# Altium schematic sheet USB_and_FTDI.SchDoc
size A4
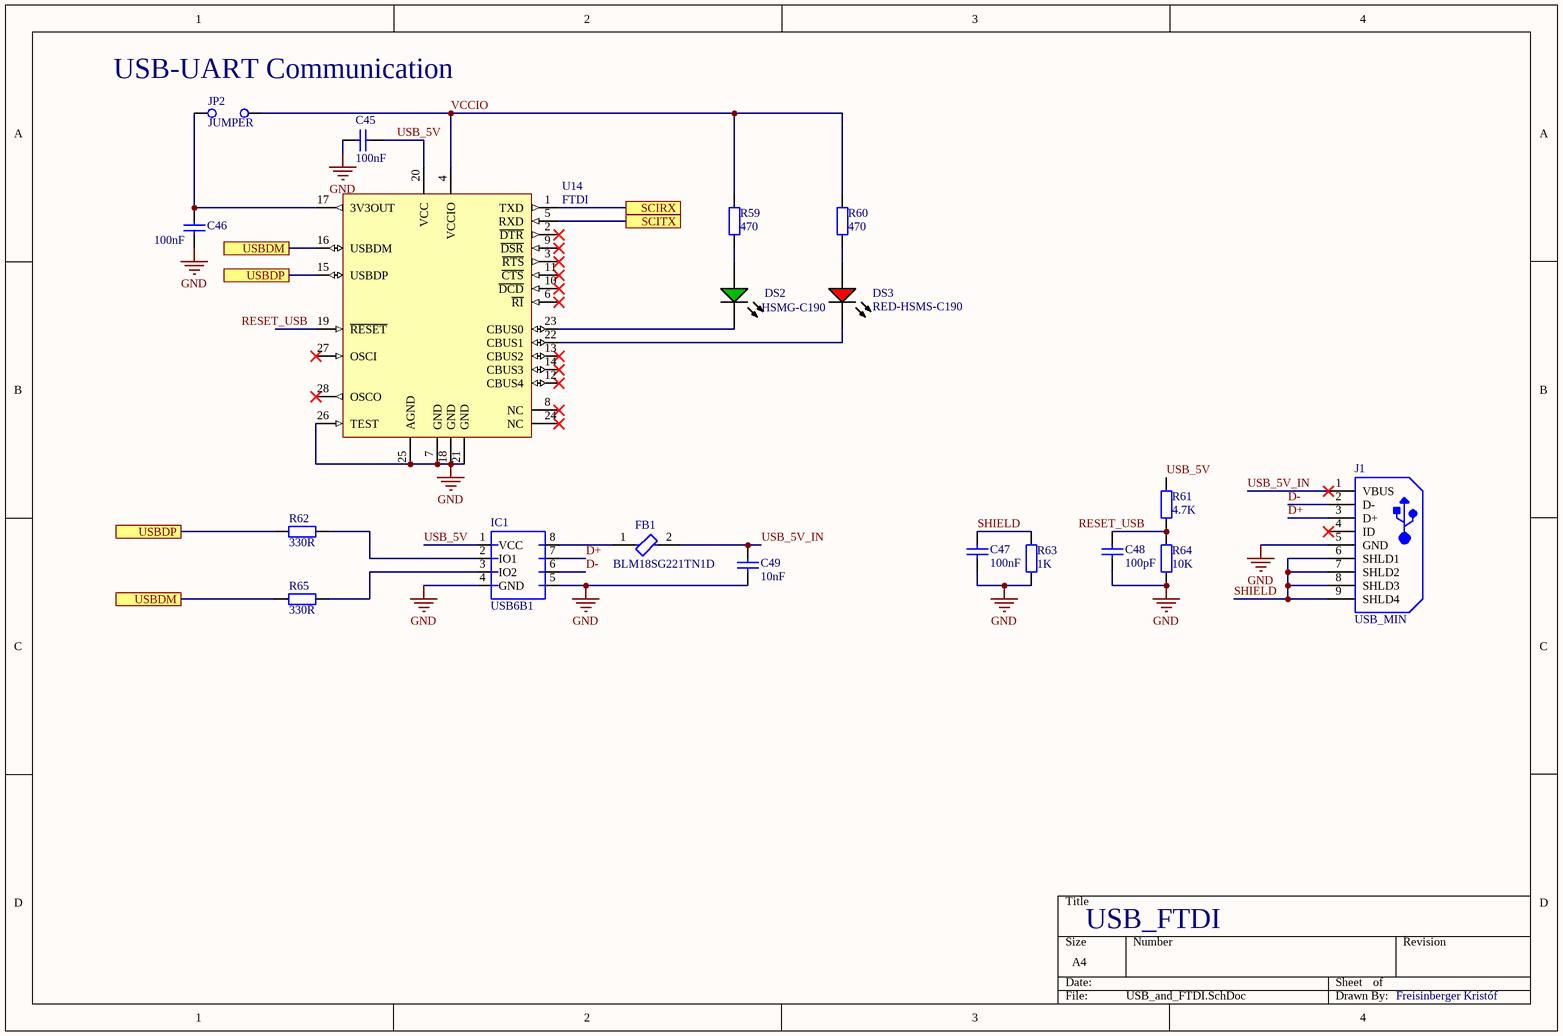
[diagram p0: USB_and_FTDI.SchDoc]

## Parts
C45  100nF  [FP_0805_CAP_085]
C46  100nF  [FP_0805_CAP_085]
C47  100nF  [FP_0805_CAP_085]
C48  100pF  [FP_0805_CAP_085]
C49  10nF  [FP_0805_CAP_085]
DS2  HSMG-C190  [AVAG-HSMX-C190_V]
DS3  RED-HSMS-C190  [AVAG-HSMX-C190_V]
FB1  BLM18SG221TN1D  [FP-BLM18-0_15-t0_5-IPC_A]
IC1  USB6B1  [INF-P-DSO-8-3_M - duplicate1]
J1  USB_MIN  [FCI-10033526-N3212LF_V]
JP2  JUMPER  [FP_CONN2_TUSKE_254MM]
R59  470  [FP_0805_RES]
R60  470  [FP_0805_RES]
R61  4.7K  [FP_0805_RES]
R62  330R  [FP_0805_RES]
R63  1K  [FP_0805_RES]
R64  10K  [FP_0805_RES]
R65  330R  [FP_0805_RES]
U14  FTDI  [SSOP-28_N]

## Ports
SCIRX, SCITX, USBDM, USBDP

## Nets
GND: C45.1 C46.1 C47.1 C48.1 C49.1 IC1.4(GND) IC1.5(GND@2) J1.5(GND) R63.1 R64.1 U14.7(GND) U14.18(GND) U14.21(GND) U14.25(AGND) U14.26(TEST)
D+: IC1.7(IO1@2) J1.3(D+)
D-: IC1.6(IO2@2) J1.2(D-)
RESET_USB: C48.2 R61.1 R64.2 U14.19(~{RESET})
SCIRX: U14.1(TXD) ; port SCIRX
SCITX: U14.5(RXD) ; port SCITX
SHIELD: C47.2 J1.6(SHLD1) J1.7(SHLD2) J1.8(SHLD3) J1.9(SHLD4) R63.2
USB_5V: C45.2 IC1.1(VCC) R61.2 U14.20(VCC)
USB_5V_IN: C49.2 FB1.2 J1.1(VBUS)
USBDM: R65.1 U14.16(USBDM) ; port USBDM
USBDP: R62.1 U14.15(USBDP) ; port USBDP
VCCIO: JP2.2(C2) R59.2 R60.2 U14.4(VCCIO)
NetC46_2: C46.2 JP2.1(C1) U14.17(3V3OUT)
NetDS2_1: DS2.1(A) R59.1
NetDS2_2: DS2.2(K) U14.23(CBUS0)
NetDS3_1: DS3.1(A) R60.1
NetDS3_2: DS3.2(K) U14.22(CBUS1)
NetFB1_1: FB1.1 IC1.8(VCC@2)
NetIC1_2: IC1.2(IO1) R62.2
NetIC1_3: IC1.3(IO2) R65.2

Not connected (* = marked no-connect by the designer): J1 4(ID)*; U14 2(~{DTR})* 3(~{RTS})* 6(~{RI})* 8(NC)* 9(~{DSR})* 10(~{DCD})* 11(~{CTS})* 12(CBUS4)* 13(CBUS2)* 14(CBUS3)* 24(NC)* 27(OSCI)* 28(OSCO)*

## Notes on the sheet
- (near JP2) USB-UART Communication
- USB_FTDI
- Freisinberger Kristóf

## Library data of the parts
C45-C49 = CAP: Capacitor
  C45-C47: Value: 100nF
  C48: Value: 100pF
  C49: Value: 10nF
DS2 = LED_G_CMP-1744-00002-1: Chip LED, Green, 2.2 V, -40 to 85 degC, 2-Pin SMD, RoHS, Tape and Reel; Frequency: 400 KHz; Max Supply Voltage: 5.5 V; Access Time: 3500 ns; Clock Frequency: 100 KHz; Case\Package: SOIC; Density: 32 kb; Nominal Supply Current: 2 mA; Interface: Serial; Min Supply Voltage: 1.7 V; Packaging: Tape and Reel; PackageReference: HSMX-C190; ComponentLink2URL: http://docs.avagotech.com/docs/AV02-0551EN; RoHSCompliant: true; Pins: 8; REACH SVHC: No SVHC; Max Operating Temperature: 85 degC; Width: 4 mm; Radiation Hardening: No; Package Quantity: 3000; ComponentLink3Description: Package Specification; ComponentLink1Description: Manufacturer URL; Min Operating Temperature: -40 degC; PackageDescription: 2-Pin Surface Mount Device, Body 1.6 x 0.8 mm, Height 0.9 mm; Max Clock Frequency: 100 KHz; Height: 1.5 mm; ComponentLink1URL: http://www.avagotech.com/; DatasheetVersion: Mar-12; ComponentLink2Description: Datasheet; Mount: Surface Mount; Length: 5 mm; ComponentLink3URL: http://www.fairchildsemi.com/dwg/MA/MA03D.pdf
DS3 = RED-CMP-2000-06427-1: LED Uni-Color Red, 52 mW, 20 mA, -40 to 85 degC, 2-Pin SMD, RoHS, Tape and Reel; Manufacturer: Avago; Reverse Voltage: 5V; Viewing Angle: 170deg; High Brightness: No; Lens Type: ColorlessDiffused; DELETED: Compliant; Product Height (mm): 0.8mm; Dominant Wave Length: 626nm; Number of  Elements: 1; Chip Material: GaP; Lum Intensity: 10mcd; Product Length (mm): 1.6mm; Forward Voltage: 2.6V; Power Dissipation: 52W; Shape Type: Rectangular; Forward Current: 25mA; Peak Wavelength: 630nm; Test Current (It): 20mA; Main Category: ChipLED; Lens Dimensions: 1x0.8x0.5mm; Pin Count: 2; Package Reference: HSMX-C190; Mounting Technology: SurfaceMount; Mounting: SurfaceMount; Datasheet URL: http://docs.avagotech.com/docs/AV02-0551EN; Package Type: ChipLed; Operating Temperature Classification: Industrial; Datasheet Version: 03/2012; Operating Temp Range: -40Cto85C; Emitting Color: Red; Rad Hardened: No; Manufacturer URL: http://www.avagotech.com/; Luminous Intensity: 10mcd; Package Description: 2-Pin Surface Mount Device, Body 1.6 x 0.8 mm, Height 0.9 mm; Type: Uni-Color; Packaging: TapeandReel; Product Depth (mm): 0.8mm
FB1 = CMP-0686-00596-3: Chip Ferrite Bead, 0603, 220Ω @ 100MHz, 25%, 0.04Ω, 2.5A; Impedance: 220R; DC Resistance-Max: 40mR; Number of Circuits: 1; Test Frequency: 100MHz; Material: Ferrite; Lead Free: Lead Free; Width: 0.8mm; Max Current Rating: 2.5A; Termination: SMD/SMT; Depth: 0.95mm; Packaging: Tape and Reel; Case Code (Metric): 1608; DC Current: 2.5A; Weight: 7.1E-05oz; Min Operating Temperature: -55°C; DC Resistance (DCR): 40mR; Max Operating Temperature: 125°C; Core Material: Ferrite; Max DC Current: 2.5A; Case/Package: 0603; REACH SVHC: No SVHC; Height: 0.8mm; Number of Pins: 2; Tolerance: 25%; RoHS Compliant: Yes; Radiation Hardening: No; Current Rating: 2.5A; Number of Lines: 1; Series: BLM18S; Case Code (Imperial): 0603; Length: 1.6mm; Package Quantity: 1
IC1 = USB6B1: Clamp Ipp Tvs Diode Surface Mount 8-SO; MF: STMicroelectronics; Package: SOIC-8 STMicroelectronics; Value: *; Availability: Unavailable; SnapEDA_Link: https://www.snapeda.com/parts/USB6B1/STMicroelectronics/view-part/51146/?ref=snap; Price: None; MP: USB6B1
J1 = USB_MIN_CMP-1698-00001-3: Mini USB B-Type, 5-Pin SMD, RoHS, Tape and Reel / 10033526-N3212LF; Height: 4 mm; PackageDescription: 5-Pin Surface Mount Device, Body 9.2 x 7.7 mm, Pitch 0.8 mm; ComponentLink2Description: Datasheet; Pins: 5; RoHSCompliant: True; DatasheetVersion: Rev. N; ComponentLink1Description: Manufacturer URL; Length: 9.9 mm; PartNumber: 10033526-N3212LF; Package Quantity: 1; Packaging: Tape and Reel; Mount: Surface Mount; Mounting Technology: Surface Mount; ComponentLink1URL: http://portal.fciconnect.com/; ComponentLink2URL: http://portal.fciconnect.com/Comergent//fci/drawing/10033526.pdf
JP2 = JUMPER: Jumper Wire
R59-R65 = RES: Resistor
  R59 R60: Value: 470
  R61: Value: 4.7K
  R62 R65: Value: 330R
  R63: Value: 1K
  R64: Value: 10K
U14 = FTDI-CMP28-0078-00029-3: USB UART Asynchronous Serial Data Transfer Chip, 28-pin SSOP, Tape and Reel; PartNumber: FT232RL-Reel; PackageVersion: Mar-12; PackageReference: SSOP-28; ComponentLink2Description: Datasheet; DatasheetVersion: ver 2.10, Mar-2012; PackageDescription: 28-Pin Small Outline Package 0.65 mm Pitch; ComponentLink1Description: Manufacturer URL; RevisionNote: DatasheetVersion updated to 2.10 Mar-2012; ComponentLink1URL: http://www.ftdichip.com/; Manufacturer: FTDI; ComponentLink2URL: http://www.ftdichip.com/Support/Documents/DataSheets/ICs/DS_FT232R.pdf